# Altium schematic sheet 24.063_24.069.SchDoc
size A4
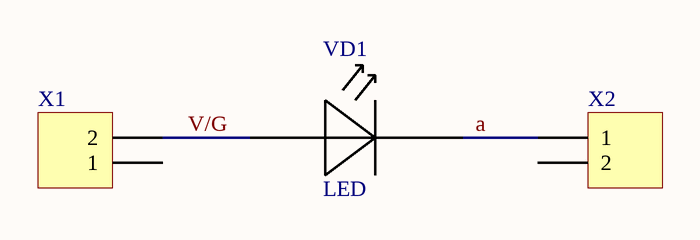
[diagram p0: 24.063_24.069.SchDoc]

## Parts
VD1  LED  [LED 24.063]
X1  Header 2  [HDR1X2]  (value not drawn)
X2  Header 2  [HDR1X2]  (value not drawn)

## Nets
a: VD1.2 X2.1
V/G: VD1.1 X1.2

Not connected (* = marked no-connect by the designer): X1 1; X2 2

## Library data of the parts
X1 X2 = Header 2: Header, 2-Pin; LatestRevisionDate: 17-Jul-2002; LatestRevisionNote: Re-released for DXP Platform.; Publisher: Altium Limited